# Altium schematic sheet Power.SchDoc: Power supply
size A4; Engineer: CT; SheetNumber: 4; SheetTotal: 5
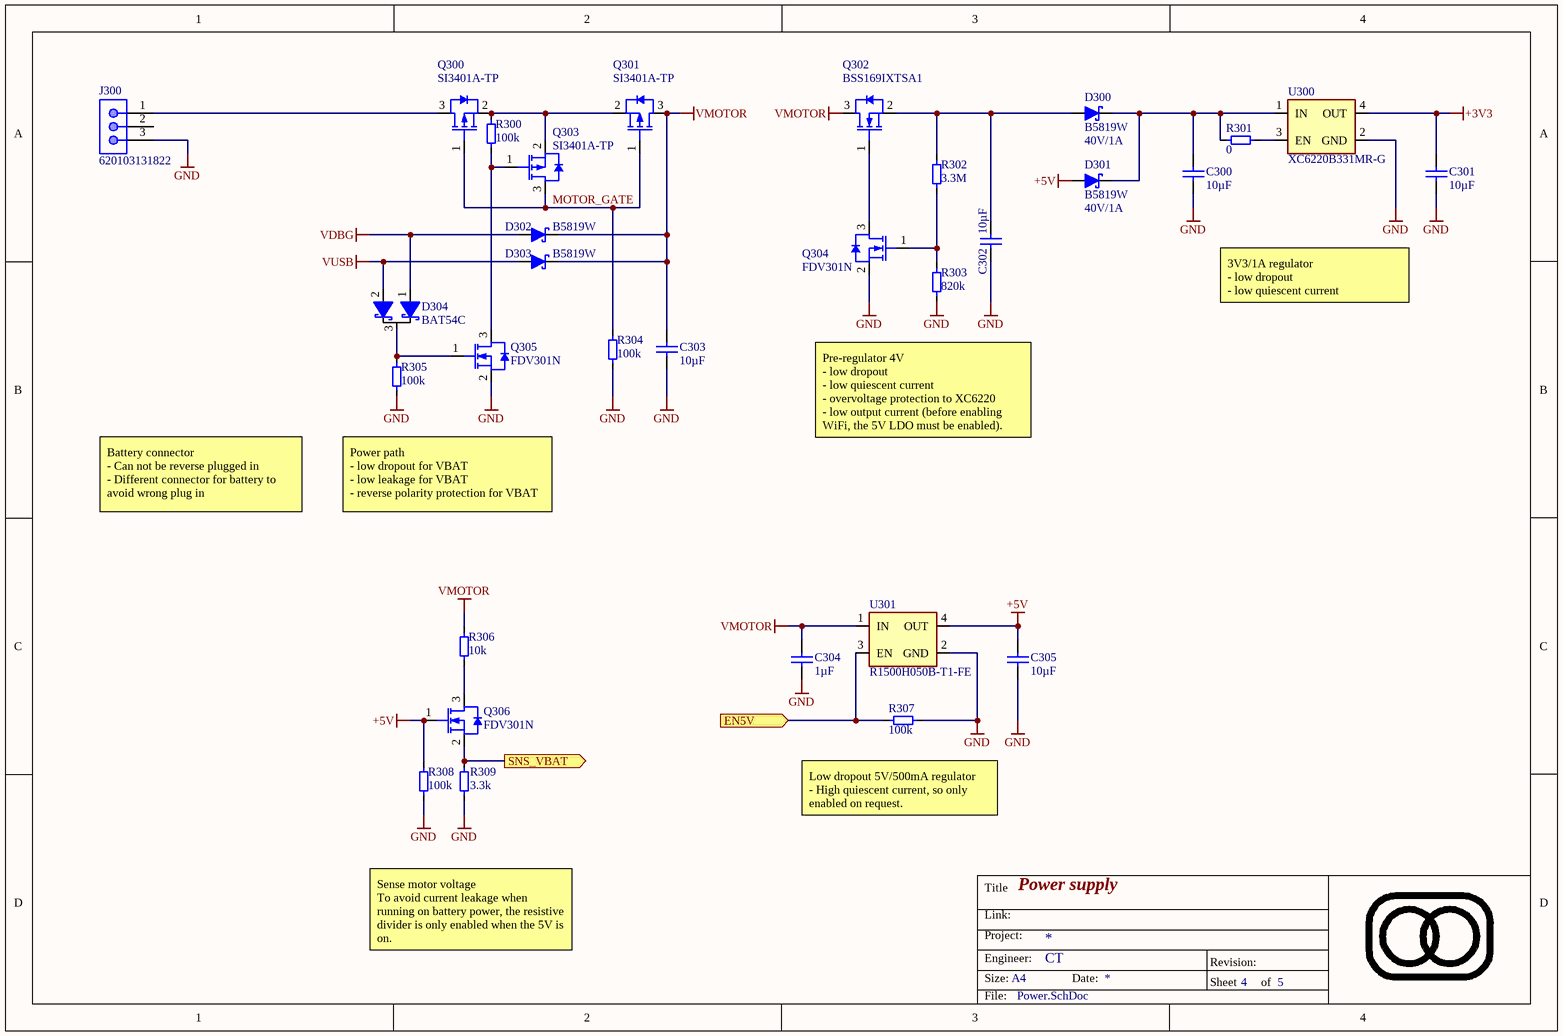
[diagram p0: Power.SchDoc]

## Parts
C300  value 10µF  [1206-C-L]  (hidden comment: Capacitor 10µF +/-10% 16V X7R 1206)
C301  value 10µF  [1206-C-L]  (hidden comment: Capacitor 10µF +/-10% 16V X7R 1206)
C302  value 10µF  [1206-C-L]  (hidden comment: Capacitor 10µF +/-10% 16V X7R 1206)
C303  value 10µF  [1206-C-L]  (hidden comment: Capacitor 10µF +/-10% 16V X7R 1206)
C304  value 1µF  [0603-C-N]  (hidden comment: Capacitor 1µF +/-10% 16V X7R 0603)
C305  value 10µF  [1206-C-L]  (hidden comment: Capacitor 10µF +/-10% 16V X7R 1206)
D300  B5819W  value 40V/1A  [SOD-123-N]
D301  B5819W  value 40V/1A  [SOD-123-N]
D302  B5819W  [SOD-123-N]
D303  B5819W  [SOD-123-N]
D304  BAT54C  [SOT-23-3-N]
J300  620103131822  [620103131822]
Q300  SI3401A-TP  [SOT-23-3-N]
Q301  SI3401A-TP  [SOT-23-3-N]
Q302  BSS169IXTSA1  [SOT-23-3-N]
Q303  SI3401A-TP  [SOT-23-3-N]
Q304  FDV301N  [SOT-23-3-N]
Q305  FDV301N  [SOT-23-3-N]
Q306  FDV301N  [SOT-23-3-N]
R300  value 100k  [0603-R-N]  (hidden comment: Resistor 100k +/-1% 75V 0603)
R301  value 0  [0603-R-N]  (hidden comment: Jumper 0R <50 mOhm 1A 0603)
R302  value 3.3M  [0603-R-N]  (hidden comment: Resistor 3.3M +/-1% 75V 0603)
R303  value 820k  [0603-R-N]  (hidden comment: Resistor 820K +/-1% 75V 0603)
R304  value 100k  [0603-R-N]  (hidden comment: Resistor 100k +/-1% 75V 0603)
R305  value 100k  [0603-R-N]  (hidden comment: Resistor 100k +/-1% 75V 0603)
R306  value 10k  [0603-R-N]  (hidden comment: Resistor 10k +/-1% 75V 0603)
R307  value 100k  [0603-R-N]  (hidden comment: Resistor 100k +/-1% 75V 0603)
R308  value 100k  [0603-R-N]  (hidden comment: Resistor 100k +/-1% 75V 0603)
R309  value 3.3k  [0603-R-N]  (hidden comment: Resistor 3.3k +/-1% 75V 0603)
U300  XC6220B331MR-G  [SOT25-N]
U301  R1500H050B-T1-FE  [SOT-89-MT5_N]

## Ports
EN5V (in), SNS_VBAT (out)

## Nets
+3V3: C301.1 U300.4(OUT)
+5V: C305.1 D301.2(A) Q306.1(G) R308.1 U301.4(OUT)
GND: C300.2 C301.2 C302.1 C303.2 C304.2 C305.2 J300.3 Q304.2(S) Q305.2(S) R303.1 R304.1 R305.1 R307.2 R308.2 R309.2 U300.2(GND) U301.2(GND)
VDBG: D302.2(A) D304.1(C1)
VMOTOR: C303.1 C304.1 D302.1(C) D303.1(C) Q301.3(DRAIN) Q302.3(D) R306.2 U301.1(IN)
VUSB: D303.2(A) D304.2(C2)
EN5V: R307.1 U301.3(EN) ; port EN5V
MOTOR_GATE: Q300.1(GATE) Q301.1(GATE) Q303.3(DRAIN) R304.2
SNS_VBAT: Q306.2(S) R309.1 ; port SNS_VBAT
NetC300_1: C300.1 D300.1(C) D301.1(C) R301.1 U300.1(IN)
NetC302_2: C302.2 D300.2(A) Q302.2(S) R302.2
NetD304_3: D304.3(A) Q305.1(G) R305.2
NetJ300_1: J300.1 Q300.3(DRAIN)
NetQ300_2: Q300.2(SOURCE) Q301.2(SOURCE) Q303.2(SOURCE) R300.2
NetQ302_1: Q302.1(G) Q304.3(D)
NetQ303_1: Q303.1(GATE) Q305.3(D) R300.1
NetQ304_1: Q304.1(G) R302.1 R303.2
NetQ306_3: Q306.3(D) R306.1
NetR301_2: R301.2 U300.3(EN)

Not connected (* = marked no-connect by the designer): J300 2

## Notes on the sheet
- 3V3/1A regulator
  - low dropout
  - low quiescent current
- Pre-regulator 4V
  - low dropout
  - low quiescent current
  - overvoltage protection to XC6220
  - low output current (before enabling WiFi, the 5V LDO must be enabled).
- Battery connector
  - Can not be reverse plugged in
  - Different connector for battery to avoid wrong plug in
- Power path
  - low dropout for VBAT
  - low leakage for VBAT
  - reverse polarity protection for VBAT
- (near R307) Low dropout 5V/500mA regulator
  - High quiescent current, so only enabled on request.
- Sense motor voltage
  To avoid current leakage when running on battery power, the resistive divider is only enabled when the 5V is on.
- Title
- Link:
- Size:
- Project:
- Engineer:
- A4
- Date:
- Revision:
- Sheet
- of
- File:

## Library data of the parts
C300-C303 C305 = CMP-072-000800-12: WCAP-CSGP Multilayer Ceramic Chip Capacitor, General Purpose, size 1206, X7R, 10µF, 16VDC; Technical Reference: X7R1206106K016DFCT10000; Tolerance: 10%; Capacitor Type: MLCC; Insulation Resistance: 0.01GO; Length: 3.2mm; ComponentLink2URL: https://www.we-online.com/redexpert/spec/885012208041?ad; Packaging: Tape and Reel; ComponentLink1Description: Website Link; Design Item ID: 885012208041; Source: WCAP-CSGP.SchLib; ComponentLink2Description: Datasheet Link; Pins: 2; Usage: General Purpose; Voltage Rating: 16V; Height: 1.6mm; ComponentLink1URL: https://www.we-online.com/redexpert/article/885012208041?ad; Dielectric: X7R; Mounting Technology: SMT; Dissipation Factor: 10%; Min Operating Temperature: -55°C; Width: 1.6mm; Max Operating Temperature: 125°C; Case/Package: 1206; Match Code: WCAP-CSGP; JLCPCB Part #: C13585
C304 = CMP-001-00004-18: Capacitor MLCC, General Purpose, size 0603, X7R, 1µF, +/-10%, 16V; Tolerance: 10%; Usage: General Purpose; Mounting Technology: SMT; Width: 0.8mm; Voltage Rating: 16V; RoHS Compliant: True; Capacitor Type: MLCC; Case/Package: 0603; Min Operating Temperature: -55°C; Dielectric: X7R; Pins: 2; Max Operating Temperature: 125°C; Length: 1.6mm; Height: 0.8mm; JLCPCB Part #: C15849
D300 D301 = CMP-004-00005-9: Schottky Barrier Rectifier, 40 V, 1 A, -65 to 125 degC, 2-Pin SOD123, RoHS, Tape and Reel; Manufacturer: Micro Commercial Components; Max Reverse Voltage (DC): 40V; Forward Voltage: 600mV; Forward Current: 1A; Datasheet URL: http://www.mccsemi.com/up_pdf/B5817W-B5819W(SOD-123).pdf; Case/Package: SOD-123; Package URL: http://www.mccsemi.com/up_pdf/1N4448W(SOD-123).pdf; Datasheet Version: Rev. B, 01/2013; JLCPCB Part #: C8598; Mounting Technology: SM; Manufacturer URL: http://www.mccsemi.com/; RoHS Compliant: Unknown; Package Reference: SOD123; Package Description: 2-Pin Small Outline Diode, Body 2.7 x 1.6 mm, Height 1.35 mm
D302 D303 = CMP-004-00005-9: Schottky Barrier Rectifier, 40 V, 1 A, -65 to 125 degC, 2-Pin SOD123, RoHS, Tape and Reel; Manufacturer: Micro Commercial Components; value: 40V/1A; Max Reverse Voltage (DC): 40V; Forward Voltage: 600mV; Forward Current: 1A; Datasheet URL: http://www.mccsemi.com/up_pdf/B5817W-B5819W(SOD-123).pdf; Case/Package: SOD-123; Package URL: http://www.mccsemi.com/up_pdf/1N4448W(SOD-123).pdf; Datasheet Version: Rev. B, 01/2013; JLCPCB Part #: C8598; Mounting Technology: SM; Manufacturer URL: http://www.mccsemi.com/; RoHS Compliant: Unknown; Package Reference: SOD123; Package Description: 2-Pin Small Outline Diode, Body 2.7 x 1.6 mm, Height 1.35 mm
D304 = CMP-004-00045-4: Rectifier Diode Small Signal Schottky 30V 0.2A 5ns Automotive 3-Pin SOT-23 T/R; Value: 10pF; Forward Current: 200mA; Current Rating: 200A; Element Configuration: Common Cathode; Max Forward Surge Current (Ifsm): 600mA; Forward Voltage: 800mV; Case/Package: SOT-23-3; Reach SVHC Compliant: Yes; Min Operating Temperature: -55°C; RoHS Compliant: Yes; Termination: SMD/SMT; Pins: 3; Packaging: Tape and Reel; Reverse Recovery Time: 5ns; Lead Free: Lead Free; Voltage: 30V; Max Repetitive Reverse Voltage (Vrrm): 30V; Max Operating Temperature: 150°C; Max Reverse Voltage (DC): 30V
J300 = CMP-047-000041-4: WR-WTB SMT Male Horizontal Shrouded Header, pitch 2mm, 3p; Withstanding Voltage: 800VAC; Working Voltage: 100VAC; Pin Number: 3; Contact Resistance: 20mOhm; Rated Current: 2A; Design Item ID: 620103131822; Part Number: 620103131822; Pitch: 2mm; Component Type: Standard; Published Date: January 2020; ComponentLink2Description: Datasheet; Pin Count: 3; Source: WR-WTB_2.00mm.SchLib; Type: Horizontal; Packaging: Tape and Reel; Operating Temperature: -25 to +85degC; ComponentLink2URL: https://www.we-online.com/catalog/datasheet/620103131822.pdf; Publisher: Wurth Elektronik; Mounting Technology: SMT; Gender: Male
Q300 Q301 Q303 = CMP-013-00056-2: Trans Mosfet P-ch 30V 4.2A 3-PIN SOT-23 T/r; Vgs(th) (Max) @ Id: -1.3V @ 250µA; Input Capacitance: 1.05nF; Rds On Max: 60mR; Max Power Dissipation: 400mW; Transistor Type: PMOS; Packaging: Cut Tape; RoHS Compliant: Yes; Vds Max: 30V; Id - Continuous Drain Current: 4.2A; Max Operating Temperature: 150°C; Series: -; Mounting Technology: Surface Mount; Case/Package: SOT-23-3; Min Operating Temperature: -55°C
Q302 = CMP-013-00057-3: Mosfet, N-Ch, 100V, 0.19A, Sot-23 Rohs Compliant: Yes; Vgs(th) (Max) @ Id: -1.8V @ 50µA; Rds On Max: 2.9Ohm; Power: 360mW; Id - Continuous Drain Current: 190mA; Transistor Type: NMOS; Case/Package: SOT-23-3; Vds Max: 100V
Q304-Q306 = CMP-013-00055-4: Transistor MOSFET N-Ch. 25V 220mA 0, 35W 4Ohm SOT23; Fall Time: 6ns; Turn-Off Delay Time: 3.5ns; Max Power Dissipation: 350mW; Number of Channels: 1; Gate to Source Voltage (Vgs): 8V; Vgs(th) (Max) @ Id: 1.06V @250µA; Turn-On Delay Time: 3.2ns; Polarity: N-CHANNEL; Drain to Source Resistance: 5R; Input Capacitance: 9.5pF; Transistor Type: NMOS; Rds On Max: 4R; Length: 2.9mm; Height: 1.2mm; Continuous Drain Current (ID): 220mA; Pins: 3; Package Quantity: 3000; Weight: 0.001093oz; Drain to Source Voltage (Vdss): 25V; Vds Max: 25V; Rise Time: 6ns; Mounting Technology: Surface Mount; Min Operating Temperature: -55°C; Case/Package: SOT-23-3; Max Operating Temperature: 150°C; Width: 1.3mm; Packaging: Tape and Reel; Id - Continuous Drain Current: 220mA; Series: -; Vgs (Max): 8V
R300 R304 R305 R307 R308 = CMP-009-00023-19: Chip Resistor, Thick Film, General Purpose, 0603, 100mW, 75V, 100 kOhm, +/-1%; Elements: 1; Tolerance: 1%; JLCPCB Part #: C25803; Min Operating Temperature: -55°C; Usage: General Purpose; Resistor Type: Thick Film; Pins: 2; Mounting Technology: SMT; Case/Package: 0603; Max Operating Temperature: 155°C; RoHS Compliant: True; Voltage Rating: 75V; Power Rating: 100mW
R301 = CMP-009-00006-18: Chip Jumper, Thick Film, Jumper, 0603, 100mW, 1A, 0 Ohm, <50 mOhm; Elements: 1; Tolerance: 50 mOhm; Voltage Rating: 75V; Pins: 2; Usage: Jumper; Min Operating Temperature: -55°C; RoHS Compliant: True; JLCPCB Part #: C21189; Case/Package: 0603; Max Operating Temperature: 155°C; Resistor Type: Thick Film; Power Rating: 100mW; Mounting Technology: SMT; Current Rating: 1A
R302 = CMP-009-00307-2: Res Thick Film 0603 3.3M Ohm 1% 1/10W ±100ppm/°C Molded SMD Paper T/R; Voltage Rating: 50V; Power Rating: 100mW; Usage: General Purpose; Number of Terminations: 2; Packaging: Tape and Reel; RoHS Compliant: Yes; Max Power Dissipation: 100mW; Case Code (Metric): 1608; Min Operating Temperature: -55°C; Series: AC; Height: 0.022inch; Case/Package: 0603; Features: Moisture Resistant,Automotive AEC-Q200; Length: 0.063inch; Termination: SMD/SMT; Width: 0.8mm; Max Operating Temperature: 155°C; Tolerance: 1%; Temperature Coefficient: 100ppm/°C; Case Code (Imperial): 0603
R303 = CMP-009-00306-2: Res Thick Film 0603 820K Ohm 1% 0.1W(1/10W) ±100ppm/C Pad SMD T/R; Usage: General Purpose; Power Rating: 100mW; Voltage Rating (DC): 50V; Temperature Coefficient: 100ppm/°C; Case Code (Metric): 1608; Height: 0.45mm; Case/Package: 0603; Lead Free: Lead Free; Width: 0.8mm; Weight: 7.1E-05oz; Case Code (Imperial): 0603; Resistance Tolerance: 1%; Military Standard: Not; Voltage Rating: 75V; Min Operating Temperature: -55°C; Tolerance: 1%; Number of Terminations: 2; Max Power Dissipation: 100mW; Reach SVHC Compliant: Unknown; Pins: 2; Termination: SMD/SMT; Depth: 0.8mm; Packaging: Tape and Reel; Features: Moisture Resistant; Construction: Rectangular; Length: 1.6mm; Resistor Type: Thick Film; RoHS Compliant: Yes; Max Operating Temperature: 155°C; Series: RC
R306 = CMP-009-00017-18: Chip Resistor, Thick Film, General Purpose, 0603, 100mW, 75V, 10 kOhm, +/-1%; Tolerance: 1%; Elements: 1; Power Rating: 100mW; Usage: General Purpose; Voltage Rating: 75V; Max Operating Temperature: 155°C; Min Operating Temperature: -55°C; RoHS Compliant: True; Pins: 2; Mounting Technology: SMT; JLCPCB Part #: C25804; Case/Package: 0603; Resistor Type: Thick Film
R309 = CMP-009-00243-9: Chip Resistor, Thick Film, General Purpose, 0603, 100mW, 75V, 3.3 kOhm, +/-1%; Tolerance: 1%; Elements: 1; Power Rating: 100mW; Voltage Rating: 75V; RoHS Compliant: Yes; Usage: General Purpose; Max Operating Temperature: 155°C; Mounting Technology: SMT; Min Operating Temperature: -55°C; Case/Package: 0603; Pins: 2; Resistor Type: Thick Film; JLCPCB Part #: C22978
U300 = CMP-019-00081-3: Linear Voltage Regulator IC Positive Fixed 1 Output 1A SOT-25-5; pin to pad: 4>5; Output Voltage: 3.3V; Max Input Voltage: 6V; Min Input Voltage: 4V; Output Current: 1A; Case/Package: SOT-23-5
U301 = CMP-019-00086-6: LDO Regulator Pos 5V 0.5A Automotive 6-Pin(5+Tab) SOT-89 T/R; pin to pad: 2>2+3 3>4 4>5; Output Type: Fixed; Output Current: 500mA; Max Input Voltage: 24V; Dropout Voltage: 225mV; Min Input Voltage: 4V; Nominal Output Voltage: 5V; Case/Package: SOT-89-5; Output Voltage: 5V